# Altium schematic sheet SampleCtrl.SchDoc
size A4
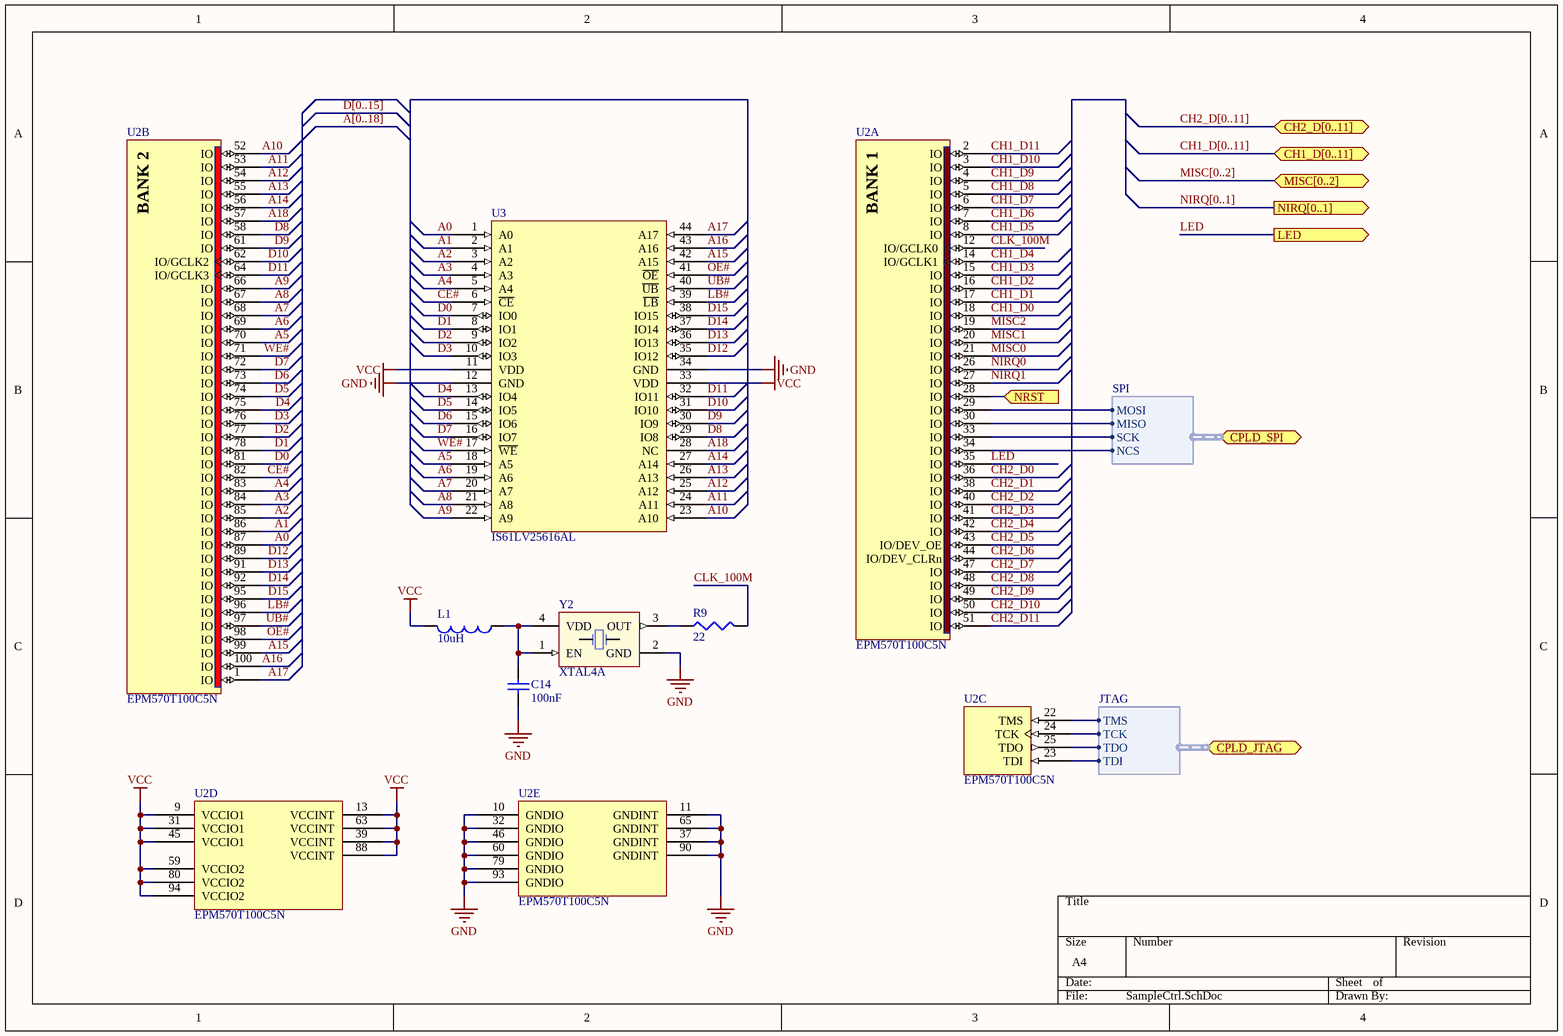
[diagram p0: SampleCtrl.SchDoc]

## Parts
C14  value 100nF  [0603C]  (hidden comment: Cap)
L1  value 10uH  [0805L]  (hidden comment: Inductor)
R9  value 22  [0603R]  (hidden comment: Res3)
U2  EPM570T100C5N  [TQFP100_N]  (parts A,B,C,D,E of 5)
U3  IS61LV25616AL  [TSOP-2L]
Y2  XTAL4A  [XTAL_7050_4P]

## Ports
CH1_D[0..11] (bidir), CH2_D[0..11] (bidir), CPLD_JTAG (harness JTAG), CPLD_SPI (harness SPI), LED (out), MISC[0..2] (bidir), NIRQ[0..1] (out), NRST (in)

## Harnesses
JTAG: TDI, TDO, TCK, TMS
SPI: MOSI, MISO, SCK, NCS

## Nets
GND: C14.2 U2.10(GNDIO) U2.11(GNDINT) U2.32(GNDIO) U2.37(GNDINT) U2.46(GNDIO) U2.60(GNDIO) U2.65(GNDINT) U2.79(GNDIO) U2.90(GNDINT) U2.93(GNDIO) U3.12(GND) U3.34(GND) Y2.2(GND)
VCC: L1.2 U2.9(VCCIO1) U2.13(VCCINT) U2.31(VCCIO1) U2.39(VCCINT) U2.45(VCCIO1) U2.59(VCCIO2) U2.63(VCCINT) U2.80(VCCIO2) U2.88(VCCINT) U2.94(VCCIO2) U3.11(VDD) U3.33(VDD)
A0: U2.87(IO) U3.1(A0)
A1: U2.86(IO) U3.2(A1)
A2: U2.85(IO) U3.3(A2)
A3: U2.84(IO) U3.4(A3)
A4: U2.83(IO) U3.5(A4)
A5: U2.70(IO) U3.18(A5)
A6: U2.69(IO) U3.19(A6)
A7: U2.68(IO) U3.20(A7)
A8: U2.67(IO) U3.21(A8)
A9: U2.66(IO) U3.22(A9)
A10: U2.52(IO) U3.23(A10)
A11: U2.53(IO) U3.24(A11)
A12: U2.54(IO) U3.25(A12)
A13: U2.55(IO) U3.26(A13)
A14: U2.56(IO) U3.27(A14)
A15: U2.99(IO) U3.42(A15)
A16: U2.100(IO) U3.43(A16)
A17: U2.1(IO) U3.44(A17)
A18: U2.57(IO) U3.28(NC)
CE#: U2.82(IO) U3.6(~{CE})
CH1_D0: U2.18(IO)
CH1_D1: U2.17(IO)
CH1_D2: U2.16(IO)
CH1_D3: U2.15(IO)
CH1_D4: U2.14(IO/GCLK1)
CH1_D5: U2.8(IO)
CH1_D6: U2.7(IO)
CH1_D7: U2.6(IO)
CH1_D8: U2.5(IO)
CH1_D9: U2.4(IO)
CH1_D10: U2.3(IO)
CH1_D11: U2.2(IO)
CH2_D0: U2.36(IO)
CH2_D1: U2.38(IO)
CH2_D2: U2.40(IO)
CH2_D3: U2.41(IO)
CH2_D4: U2.42(IO)
CH2_D5: U2.43(IO/DEV_OE)
CH2_D6: U2.44(IO/DEV_CLRn)
CH2_D7: U2.47(IO)
CH2_D8: U2.48(IO)
CH2_D9: U2.49(IO)
CH2_D10: U2.50(IO)
CH2_D11: U2.51(IO)
CLK_100M: R9.2 U2.12(IO/GCLK0)
D0: U2.81(IO) U3.7(IO0)
D1: U2.78(IO) U3.8(IO1)
D2: U2.77(IO) U3.9(IO2)
D3: U2.76(IO) U3.10(IO3)
D4: U2.75(IO) U3.13(IO4)
D5: U2.74(IO) U3.14(IO5)
D6: U2.73(IO) U3.15(IO6)
D7: U2.72(IO) U3.16(IO7)
D8: U2.58(IO) U3.29(IO8)
D9: U2.61(IO) U3.30(IO9)
D10: U2.62(IO/GCLK2) U3.31(IO10)
D11: U2.64(IO/GCLK3) U3.32(IO11)
D12: U2.89(IO) U3.35(IO12)
D13: U2.91(IO) U3.36(IO13)
D14: U2.92(IO) U3.37(IO14)
D15: U2.95(IO) U3.38(IO15)
LB#: U2.96(IO) U3.39(~{LB})
LED: U2.35(IO) ; port LED
MISC0: U2.21(IO)
MISC1: U2.20(IO)
MISC2: U2.19(IO)
NIRQ0: U2.26(IO)
NIRQ1: U2.27(IO)
NRST: U2.28(IO) ; port NRST
OE#: U2.98(IO) U3.41(~{OE})
UB#: U2.97(IO) U3.40(~{UB})
WE#: U2.71(IO) U3.17(~{WE})
NetC14_1: C14.1 L1.1 Y2.1(EN) Y2.4(VDD)
NetR9_1: R9.1 Y2.3(OUT)
NetU2_22: U2.22(TMS) ; port CPLD_JTAG.TMS
NetU2_23: U2.23(TDI) ; port CPLD_JTAG.TDI
NetU2_24: U2.24(TCK) ; port CPLD_JTAG.TCK
NetU2_25: U2.25(TDO) ; port CPLD_JTAG.TDO
NetU2_29: U2.29(IO) ; port CPLD_SPI.MOSI
NetU2_30: U2.30(IO) ; port CPLD_SPI.MISO
NetU2_33: U2.33(IO) ; port CPLD_SPI.SCK
NetU2_34: U2.34(IO) ; port CPLD_SPI.NCS

## Buses and harness runs
bus A[0..18]
bus CH1_D[0..11] = port CH1_D[0..11]
bus CH2_D[0..11] = port CH2_D[0..11]
bus D[0..15]
bus MISC[0..2] = port MISC[0..2]
bus NIRQ[0..1] = port NIRQ[0..1]

## Notes on the sheet
- (in symbol EPM570T100C5N, part A) BANK 1
- (in symbol EPM570T100C5N, part B) BANK 2

## Library data of the parts
C14 = Cap: Capacitor; Published: 8-Jun-2000; LatestRevisionDate: 17-Jul-2002; LatestRevisionNote: Re-released for DXP Platform.; PackageReference: CAPC2012L; Publisher: Altium Limited
L1 = Inductor: Code_IEC: 1005; Published: 8-Jun-2000; LatestRevisionDate: 29-May-2009; LatestRevisionNote: IPC-7351 Footprint Added.; PackageReference: 0402-A; Publisher: Altium Limited; PackageDescription: Chip Inductor; Code_JEITA: 0402
R9 = Res3: Resistor; Published: 8-Jun-2000; LatestRevisionDate: 29-May-2009; LatestRevisionNote: IPC-7351 Footprint Added.; PackageReference: J1-0603; Publisher: Altium Limited; PackageDescription: Chip Resistor
U2 = EPM570T100C5N: MAX II 3.3/2.5V CPLD, 76 IOs, 570 Logic Elements, 100-Pin Plastic TQFP, Commercial Temperature, Speed Grade 5, Pb-Free; Note: Each set of VCCIO pins can be connected to 3.3V, 2.5V, 1.8V, or 1.5V.; Note: All VCCINT pins must be connected to either 3.3V or 2.5V (but not a combination of both).; Published: 4-Mar-2005; LatestRevisionDate: 13-Apr-2006; LatestRevisionNote: IPC-7351 Footprint Added.; DatasheetVersion: ver1.8, Jul-2006; PackageVersion: ver14.3, Jul-2006; PackageReference: TQFP100; Publisher: Altium Limited; PackageDescription: 100-Pin Plastic Thin Quad Flat Pack (TQFP100); Code_JEDEC: MS-026-AED; ComponentLink1Description: Manufacturer Link; ComponentLink1URL: http://www.altera.com/products/devices/cpld/max2/mx2-index.jsp; ComponentLink2Description: Handbook; ComponentLink2URL: http://www.altera.com/literature/hb/max2/max2_mii5v1.pdf; ComponentLink3Description: Packaging Specification; ComponentLink3URL: http://www.altera.com/literature/ds/dspkg.pdf
U3 = IS61LV25616AL: 256K*16 SRAM, 3.3V
Y2 = XTAL4A: 4脚有源晶振